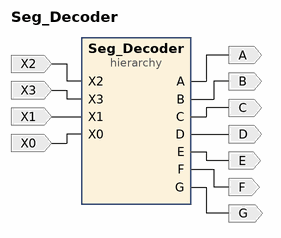
[diagram p0: block diagram of the top level]
# Vivado block design Seg_Decoder, xc7a35tcpg236-1, Vivado 2018.3
create_bd_design Seg_Decoder

create_bd_port -dir O A
create_bd_port -dir I X0
create_bd_port -dir I X1
create_bd_port -dir I X2
create_bd_port -dir I X3
create_bd_port -dir O B
create_bd_port -dir O C
create_bd_port -dir O D
create_bd_port -dir O E
create_bd_port -dir O F
create_bd_port -dir O G

create_bd_cell -type hier Seg_Decoder

# ---- hierarchy /Seg_Decoder ----
current_bd_instance /Seg_Decoder
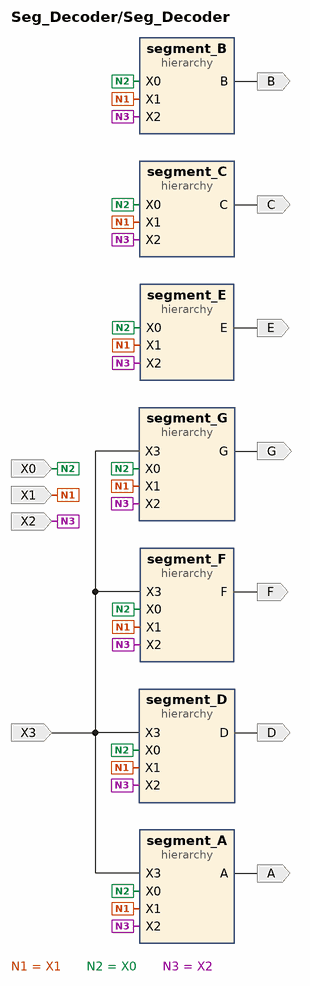
[diagram p1: block diagram inside /Seg_Decoder]
create_bd_pin -dir I X1
create_bd_pin -dir I X0
create_bd_pin -dir I X3
create_bd_pin -dir I X2
create_bd_pin -dir O A
create_bd_pin -dir O B
create_bd_pin -dir O C
create_bd_pin -dir O D
create_bd_pin -dir O E
create_bd_pin -dir O F
create_bd_pin -dir O G

create_bd_cell -type hier segment_A
create_bd_cell -type hier segment_B
create_bd_cell -type hier segment_C
create_bd_cell -type hier segment_D
create_bd_cell -type hier segment_E
create_bd_cell -type hier segment_F
create_bd_cell -type hier segment_G

# ---- hierarchy /Seg_Decoder/segment_A ----
current_bd_instance /Seg_Decoder/segment_A
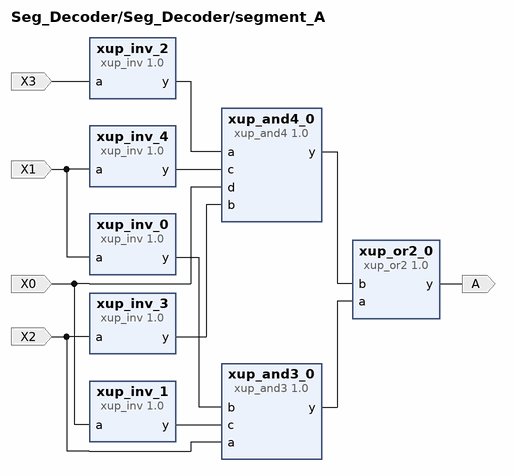
[diagram p2: block diagram inside /Seg_Decoder/segment_A]
create_bd_pin -dir I X1
create_bd_pin -dir I X0
create_bd_pin -dir I X3
create_bd_pin -dir I X2
create_bd_pin -dir O A

create_bd_cell -type ip -vlnv xilinx.com:xup:xup_inv:1.0 xup_inv_0
set_property -dict {CONFIG.DELAY 0} [get_bd_cells xup_inv_0]
create_bd_cell -type ip -vlnv xilinx.com:xup:xup_inv:1.0 xup_inv_1
set_property -dict {CONFIG.DELAY 0} [get_bd_cells xup_inv_1]
create_bd_cell -type ip -vlnv xilinx.com:xup:xup_inv:1.0 xup_inv_2
set_property -dict {CONFIG.DELAY 0} [get_bd_cells xup_inv_2]
create_bd_cell -type ip -vlnv xilinx.com:xup:xup_inv:1.0 xup_inv_3
set_property -dict {CONFIG.DELAY 0} [get_bd_cells xup_inv_3]
create_bd_cell -type ip -vlnv xilinx.com:xup:xup_inv:1.0 xup_inv_4
set_property -dict {CONFIG.DELAY 0} [get_bd_cells xup_inv_4]
create_bd_cell -type ip -vlnv xilinx.com:xup:xup_and3:1.0 xup_and3_0
set_property -dict {CONFIG.DELAY 0} [get_bd_cells xup_and3_0]
create_bd_cell -type ip -vlnv xilinx.com:xup:xup_and4:1.0 xup_and4_0
set_property -dict {CONFIG.DELAY 0} [get_bd_cells xup_and4_0]
create_bd_cell -type ip -vlnv xilinx.com:xup:xup_or2:1.0 xup_or2_0
set_property -dict {CONFIG.DELAY 0} [get_bd_cells xup_or2_0]

# ---- hierarchy /Seg_Decoder/segment_B ----
current_bd_instance /Seg_Decoder/segment_B
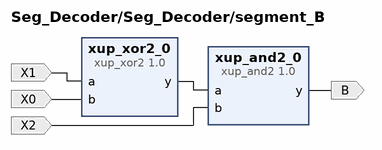
[diagram p3: block diagram inside /Seg_Decoder/segment_B]
create_bd_pin -dir I X1
create_bd_pin -dir I X0
create_bd_pin -dir I X2
create_bd_pin -dir O B

create_bd_cell -type ip -vlnv xilinx.com:xup:xup_xor2:1.0 xup_xor2_0
set_property -dict {CONFIG.DELAY 0} [get_bd_cells xup_xor2_0]
create_bd_cell -type ip -vlnv xilinx.com:xup:xup_and2:1.0 xup_and2_0
set_property -dict {CONFIG.DELAY 0} [get_bd_cells xup_and2_0]

# ---- hierarchy /Seg_Decoder/segment_C ----
current_bd_instance /Seg_Decoder/segment_C
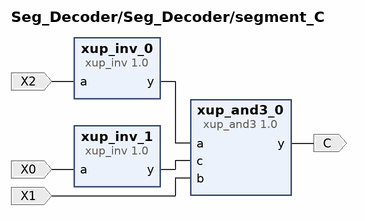
[diagram p4: block diagram inside /Seg_Decoder/segment_C]
create_bd_pin -dir I X1
create_bd_pin -dir O C
create_bd_pin -dir I X2
create_bd_pin -dir I X0

create_bd_cell -type ip -vlnv xilinx.com:xup:xup_and3:1.0 xup_and3_0
set_property -dict {CONFIG.DELAY 0} [get_bd_cells xup_and3_0]
create_bd_cell -type ip -vlnv xilinx.com:xup:xup_inv:1.0 xup_inv_0
set_property -dict {CONFIG.DELAY 0} [get_bd_cells xup_inv_0]
create_bd_cell -type ip -vlnv xilinx.com:xup:xup_inv:1.0 xup_inv_1
set_property -dict {CONFIG.DELAY 0} [get_bd_cells xup_inv_1]

# ---- hierarchy /Seg_Decoder/segment_D ----
current_bd_instance /Seg_Decoder/segment_D
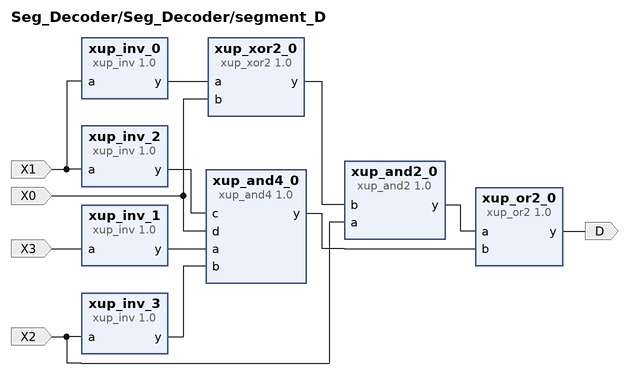
[diagram p5: block diagram inside /Seg_Decoder/segment_D]
create_bd_pin -dir I X0
create_bd_pin -dir I X1
create_bd_pin -dir I X3
create_bd_pin -dir I X2
create_bd_pin -dir O D

create_bd_cell -type ip -vlnv xilinx.com:xup:xup_and4:1.0 xup_and4_0
set_property -dict {CONFIG.DELAY 0} [get_bd_cells xup_and4_0]
create_bd_cell -type ip -vlnv xilinx.com:xup:xup_xor2:1.0 xup_xor2_0
set_property -dict {CONFIG.DELAY 0} [get_bd_cells xup_xor2_0]
create_bd_cell -type ip -vlnv xilinx.com:xup:xup_inv:1.0 xup_inv_0
set_property -dict {CONFIG.DELAY 0} [get_bd_cells xup_inv_0]
create_bd_cell -type ip -vlnv xilinx.com:xup:xup_inv:1.0 xup_inv_1
set_property -dict {CONFIG.DELAY 0} [get_bd_cells xup_inv_1]
create_bd_cell -type ip -vlnv xilinx.com:xup:xup_inv:1.0 xup_inv_2
set_property -dict {CONFIG.DELAY 0} [get_bd_cells xup_inv_2]
create_bd_cell -type ip -vlnv xilinx.com:xup:xup_and2:1.0 xup_and2_0
set_property -dict {CONFIG.DELAY 0} [get_bd_cells xup_and2_0]
create_bd_cell -type ip -vlnv xilinx.com:xup:xup_inv:1.0 xup_inv_3
set_property -dict {CONFIG.DELAY 0} [get_bd_cells xup_inv_3]
create_bd_cell -type ip -vlnv xilinx.com:xup:xup_or2:1.0 xup_or2_0
set_property -dict {CONFIG.DELAY 0} [get_bd_cells xup_or2_0]

# ---- hierarchy /Seg_Decoder/segment_E ----
current_bd_instance /Seg_Decoder/segment_E
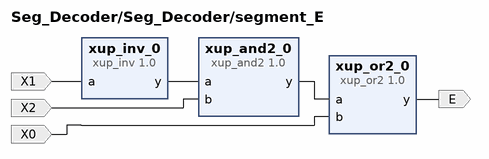
[diagram p6: block diagram inside /Seg_Decoder/segment_E]
create_bd_pin -dir I X1
create_bd_pin -dir I X2
create_bd_pin -dir I X0
create_bd_pin -dir O E

create_bd_cell -type ip -vlnv xilinx.com:xup:xup_inv:1.0 xup_inv_0
set_property -dict {CONFIG.DELAY 0} [get_bd_cells xup_inv_0]
create_bd_cell -type ip -vlnv xilinx.com:xup:xup_and2:1.0 xup_and2_0
set_property -dict {CONFIG.DELAY 0} [get_bd_cells xup_and2_0]
create_bd_cell -type ip -vlnv xilinx.com:xup:xup_or2:1.0 xup_or2_0
set_property -dict {CONFIG.DELAY 0} [get_bd_cells xup_or2_0]

# ---- hierarchy /Seg_Decoder/segment_F ----
current_bd_instance /Seg_Decoder/segment_F
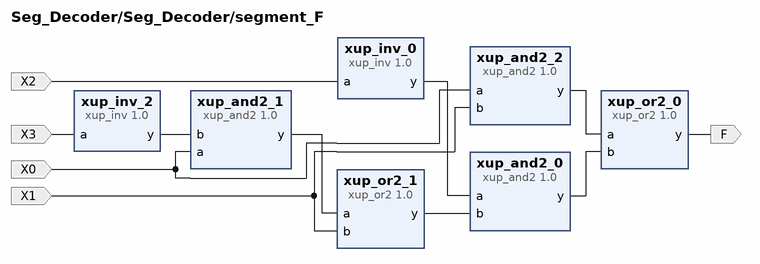
[diagram p7: block diagram inside /Seg_Decoder/segment_F]
create_bd_pin -dir I X0
create_bd_pin -dir O F
create_bd_pin -dir I X1
create_bd_pin -dir I X3
create_bd_pin -dir I X2

create_bd_cell -type ip -vlnv xilinx.com:xup:xup_inv:1.0 xup_inv_0
set_property -dict {CONFIG.DELAY 0} [get_bd_cells xup_inv_0]
create_bd_cell -type ip -vlnv xilinx.com:xup:xup_inv:1.0 xup_inv_2
set_property -dict {CONFIG.DELAY 0} [get_bd_cells xup_inv_2]
create_bd_cell -type ip -vlnv xilinx.com:xup:xup_and2:1.0 xup_and2_0
set_property -dict {CONFIG.DELAY 0} [get_bd_cells xup_and2_0]
create_bd_cell -type ip -vlnv xilinx.com:xup:xup_or2:1.0 xup_or2_0
set_property -dict {CONFIG.DELAY 0} [get_bd_cells xup_or2_0]
create_bd_cell -type ip -vlnv xilinx.com:xup:xup_and2:1.0 xup_and2_1
set_property -dict {CONFIG.DELAY 0} [get_bd_cells xup_and2_1]
create_bd_cell -type ip -vlnv xilinx.com:xup:xup_and2:1.0 xup_and2_2
set_property -dict {CONFIG.DELAY 0} [get_bd_cells xup_and2_2]
create_bd_cell -type ip -vlnv xilinx.com:xup:xup_or2:1.0 xup_or2_1
set_property -dict {CONFIG.DELAY 0} [get_bd_cells xup_or2_1]

# ---- hierarchy /Seg_Decoder/segment_G ----
current_bd_instance /Seg_Decoder/segment_G
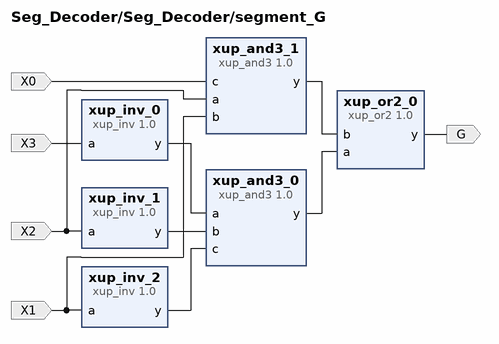
[diagram p8: block diagram inside /Seg_Decoder/segment_G]
create_bd_pin -dir I X2
create_bd_pin -dir I X1
create_bd_pin -dir I X0
create_bd_pin -dir I X3
create_bd_pin -dir O G

create_bd_cell -type ip -vlnv xilinx.com:xup:xup_and3:1.0 xup_and3_0
set_property -dict {CONFIG.DELAY 0} [get_bd_cells xup_and3_0]
create_bd_cell -type ip -vlnv xilinx.com:xup:xup_and3:1.0 xup_and3_1
set_property -dict {CONFIG.DELAY 0} [get_bd_cells xup_and3_1]
create_bd_cell -type ip -vlnv xilinx.com:xup:xup_inv:1.0 xup_inv_0
set_property -dict {CONFIG.DELAY 0} [get_bd_cells xup_inv_0]
create_bd_cell -type ip -vlnv xilinx.com:xup:xup_inv:1.0 xup_inv_1
set_property -dict {CONFIG.DELAY 0} [get_bd_cells xup_inv_1]
create_bd_cell -type ip -vlnv xilinx.com:xup:xup_inv:1.0 xup_inv_2
set_property -dict {CONFIG.DELAY 0} [get_bd_cells xup_inv_2]
create_bd_cell -type ip -vlnv xilinx.com:xup:xup_or2:1.0 xup_or2_0
set_property -dict {CONFIG.DELAY 0} [get_bd_cells xup_or2_0]

# ---- connections ----

current_bd_instance /Seg_Decoder
connect_bd_net -net a_1_1 [get_bd_pins X1] \
  [get_bd_pins segment_B/X1] [get_bd_pins segment_C/X1] [get_bd_pins segment_D/X1] [get_bd_pins segment_E/X1] \
  [get_bd_pins segment_F/X1] [get_bd_pins segment_G/X1] [get_bd_pins segment_A/X1]
connect_bd_net -net a_2_1 [get_bd_pins X0] \
  [get_bd_pins segment_E/X0] [get_bd_pins segment_F/X0] [get_bd_pins segment_G/X0] [get_bd_pins segment_D/X0] \
  [get_bd_pins segment_B/X0] [get_bd_pins segment_C/X0] [get_bd_pins segment_A/X0]
connect_bd_net -net a_0_2 [get_bd_pins X3] [get_bd_pins segment_D/X3] [get_bd_pins segment_F/X3] [get_bd_pins segment_G/X3] [get_bd_pins segment_A/X3]
connect_bd_net -net a_0_1 [get_bd_pins X2] \
  [get_bd_pins segment_B/X2] [get_bd_pins segment_C/X2] [get_bd_pins segment_D/X2] [get_bd_pins segment_E/X2] \
  [get_bd_pins segment_F/X2] [get_bd_pins segment_G/X2] [get_bd_pins segment_A/X2]
connect_bd_net -net xup_or2_0_y [get_bd_pins segment_A/A] [get_bd_pins A]
connect_bd_net -net xup_and2_0_y [get_bd_pins segment_B/B] [get_bd_pins B]
connect_bd_net -net xup_and3_0_y [get_bd_pins segment_C/C] [get_bd_pins C]
connect_bd_net -net xup_or2_0_y1 [get_bd_pins segment_D/D] [get_bd_pins D]
connect_bd_net -net xup_or2_0_y2 [get_bd_pins segment_E/E] [get_bd_pins E]
connect_bd_net -net xup_or3_0_y [get_bd_pins segment_F/F] [get_bd_pins F]
connect_bd_net -net xup_or2_0_y3 [get_bd_pins segment_G/G] [get_bd_pins G]

current_bd_instance /Seg_Decoder/segment_A
connect_bd_net [get_bd_pins xup_inv_0/y] [get_bd_pins xup_and3_0/b]
connect_bd_net [get_bd_pins xup_inv_1/y] [get_bd_pins xup_and3_0/c]
connect_bd_net [get_bd_pins xup_inv_2/y] [get_bd_pins xup_and4_0/a]
connect_bd_net [get_bd_pins xup_inv_3/y] [get_bd_pins xup_and4_0/b]
connect_bd_net [get_bd_pins xup_inv_4/y] [get_bd_pins xup_and4_0/c]
connect_bd_net [get_bd_pins xup_and3_0/y] [get_bd_pins xup_or2_0/a]
connect_bd_net [get_bd_pins xup_and4_0/y] [get_bd_pins xup_or2_0/b]
connect_bd_net -net a_1_1 [get_bd_pins X1] [get_bd_pins xup_inv_4/a] [get_bd_pins xup_inv_0/a]
connect_bd_net -net a_2_1 [get_bd_pins X0] [get_bd_pins xup_and4_0/d] [get_bd_pins xup_inv_1/a]
connect_bd_net -net a_0_2 [get_bd_pins X3] [get_bd_pins xup_inv_2/a]
connect_bd_net -net a_0_1 [get_bd_pins X2] [get_bd_pins xup_and3_0/a] [get_bd_pins xup_inv_3/a]
connect_bd_net [get_bd_pins xup_or2_0/y] [get_bd_pins A]

current_bd_instance /Seg_Decoder/segment_B
connect_bd_net [get_bd_pins xup_xor2_0/y] [get_bd_pins xup_and2_0/a]
connect_bd_net -net X1_1 [get_bd_pins X1] [get_bd_pins xup_xor2_0/a]
connect_bd_net -net X0_1 [get_bd_pins X0] [get_bd_pins xup_xor2_0/b]
connect_bd_net -net X2_1 [get_bd_pins X2] [get_bd_pins xup_and2_0/b]
connect_bd_net [get_bd_pins xup_and2_0/y] [get_bd_pins B]

current_bd_instance /Seg_Decoder/segment_C
connect_bd_net [get_bd_pins xup_inv_0/y] [get_bd_pins xup_and3_0/a]
connect_bd_net [get_bd_pins xup_inv_1/y] [get_bd_pins xup_and3_0/c]
connect_bd_net -net b_0_1 [get_bd_pins X1] [get_bd_pins xup_and3_0/b]
connect_bd_net [get_bd_pins xup_and3_0/y] [get_bd_pins C]
connect_bd_net -net a_0_1 [get_bd_pins X2] [get_bd_pins xup_inv_0/a]
connect_bd_net -net a_1_1 [get_bd_pins X0] [get_bd_pins xup_inv_1/a]

current_bd_instance /Seg_Decoder/segment_D
connect_bd_net [get_bd_pins xup_inv_1/y] [get_bd_pins xup_and4_0/a]
connect_bd_net [get_bd_pins xup_inv_3/y] [get_bd_pins xup_and4_0/b]
connect_bd_net [get_bd_pins xup_inv_2/y] [get_bd_pins xup_and4_0/c]
connect_bd_net [get_bd_pins xup_and4_0/y] [get_bd_pins xup_or2_0/b]
connect_bd_net [get_bd_pins xup_inv_0/y] [get_bd_pins xup_xor2_0/a]
connect_bd_net [get_bd_pins xup_xor2_0/y] [get_bd_pins xup_and2_0/b]
connect_bd_net [get_bd_pins xup_and2_0/y] [get_bd_pins xup_or2_0/a]
connect_bd_net -net d_0_1 [get_bd_pins X0] [get_bd_pins xup_xor2_0/b] [get_bd_pins xup_and4_0/d]
connect_bd_net -net a_0_1 [get_bd_pins X1] [get_bd_pins xup_inv_2/a] [get_bd_pins xup_inv_0/a]
connect_bd_net -net a_2_1 [get_bd_pins X3] [get_bd_pins xup_inv_1/a]
connect_bd_net -net a_1_1 [get_bd_pins X2] [get_bd_pins xup_inv_3/a] [get_bd_pins xup_and2_0/a]
connect_bd_net [get_bd_pins xup_or2_0/y] [get_bd_pins D]

current_bd_instance /Seg_Decoder/segment_E
connect_bd_net [get_bd_pins xup_inv_0/y] [get_bd_pins xup_and2_0/a]
connect_bd_net [get_bd_pins xup_and2_0/y] [get_bd_pins xup_or2_0/a]
connect_bd_net -net a_0_1 [get_bd_pins X1] [get_bd_pins xup_inv_0/a]
connect_bd_net -net b_0_1 [get_bd_pins X2] [get_bd_pins xup_and2_0/b]
connect_bd_net -net b_1_1 [get_bd_pins X0] [get_bd_pins xup_or2_0/b]
connect_bd_net [get_bd_pins xup_or2_0/y] [get_bd_pins E]

current_bd_instance /Seg_Decoder/segment_F
connect_bd_net [get_bd_pins xup_or2_0/y] [get_bd_pins F]
connect_bd_net [get_bd_pins xup_inv_0/y] [get_bd_pins xup_and2_0/a]
connect_bd_net -net X2_1 [get_bd_pins X2] [get_bd_pins xup_inv_0/a]
connect_bd_net [get_bd_pins xup_and2_0/y] [get_bd_pins xup_or2_0/b]
connect_bd_net [get_bd_pins xup_and2_2/y] [get_bd_pins xup_or2_0/a]
connect_bd_net -net X0_1 [get_bd_pins X0] [get_bd_pins xup_and2_2/a] [get_bd_pins xup_and2_1/a]
connect_bd_net -net X1_1 [get_bd_pins X1] [get_bd_pins xup_and2_2/b] [get_bd_pins xup_or2_1/b]
connect_bd_net [get_bd_pins xup_or2_1/y] [get_bd_pins xup_and2_0/b]
connect_bd_net [get_bd_pins xup_and2_1/y] [get_bd_pins xup_or2_1/a]
connect_bd_net -net X3_1 [get_bd_pins X3] [get_bd_pins xup_inv_2/a]
connect_bd_net [get_bd_pins xup_inv_2/y] [get_bd_pins xup_and2_1/b]

current_bd_instance /Seg_Decoder/segment_G
connect_bd_net [get_bd_pins xup_inv_0/y] [get_bd_pins xup_and3_0/a]
connect_bd_net [get_bd_pins xup_inv_1/y] [get_bd_pins xup_and3_0/b]
connect_bd_net [get_bd_pins xup_inv_2/y] [get_bd_pins xup_and3_0/c]
connect_bd_net [get_bd_pins xup_and3_0/y] [get_bd_pins xup_or2_0/a]
connect_bd_net [get_bd_pins xup_and3_1/y] [get_bd_pins xup_or2_0/b]
connect_bd_net -net a_1_1 [get_bd_pins X2] [get_bd_pins xup_inv_1/a] [get_bd_pins xup_and3_1/a]
connect_bd_net -net a_2_1 [get_bd_pins X1] [get_bd_pins xup_inv_2/a] [get_bd_pins xup_and3_1/b]
connect_bd_net -net c_0_1 [get_bd_pins X0] [get_bd_pins xup_and3_1/c]
connect_bd_net -net a_0_1 [get_bd_pins X3] [get_bd_pins xup_inv_0/a]
connect_bd_net [get_bd_pins xup_or2_0/y] [get_bd_pins G]

current_bd_instance /
connect_bd_net -net a_0_1 [get_bd_ports X2] [get_bd_pins Seg_Decoder/X2]
connect_bd_net -net a_0_2 [get_bd_ports X3] [get_bd_pins Seg_Decoder/X3]
connect_bd_net -net a_1_1 [get_bd_ports X1] [get_bd_pins Seg_Decoder/X1]
connect_bd_net -net a_2_1 [get_bd_ports X0] [get_bd_pins Seg_Decoder/X0]
connect_bd_net -net xup_or2_0_y [get_bd_pins Seg_Decoder/A] [get_bd_ports A]
connect_bd_net -net xup_and2_0_y [get_bd_pins Seg_Decoder/B] [get_bd_ports B]
connect_bd_net -net xup_and3_0_y [get_bd_pins Seg_Decoder/C] [get_bd_ports C]
connect_bd_net -net xup_or2_0_y1 [get_bd_pins Seg_Decoder/D] [get_bd_ports D]
connect_bd_net -net xup_or2_0_y2 [get_bd_pins Seg_Decoder/E] [get_bd_ports E]
connect_bd_net -net xup_or3_0_y [get_bd_pins Seg_Decoder/F] [get_bd_ports F]
connect_bd_net -net xup_or2_0_y3 [get_bd_pins Seg_Decoder/G] [get_bd_ports G]

validate_bd_design
save_bd_design
